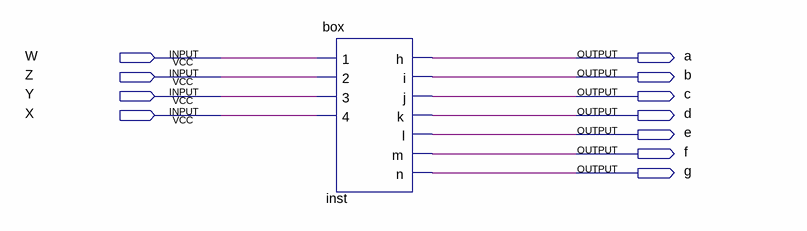
[diagram p0: schematic sheet]
// Quartus schematic bcd.bdf as structural Verilog: 1 symbols, 11 pins
module bcd (
  input  W,
  input  Z,
  input  Y,
  input  X,
  output a,
  output b,
  output c,
  output d,
  output e,
  output f,
  output g
);

  box inst (.\1 (W), .\2 (Z), .\3 (Y), .\4 (X), .h(a), .i(b), .j(c), .k(d), .l(e), .m(f), .n(g));
endmodule
